# Altium schematic sheet Electrical_Design.SchDoc
size A4; SheetNumber: 1; SheetTotal: 2
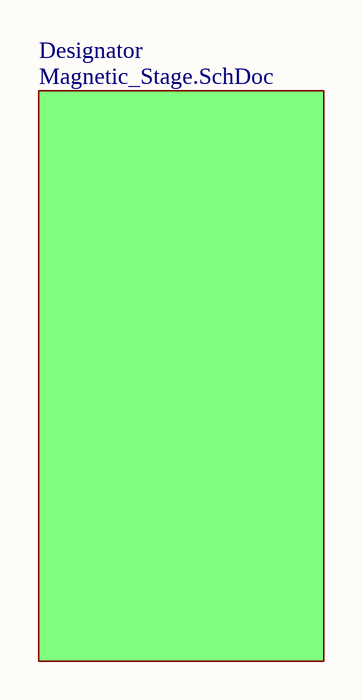
[diagram p0: Electrical_Design.SchDoc]

## Sub-sheets
Designator = Magnetic_Stage.SchDoc: no entries